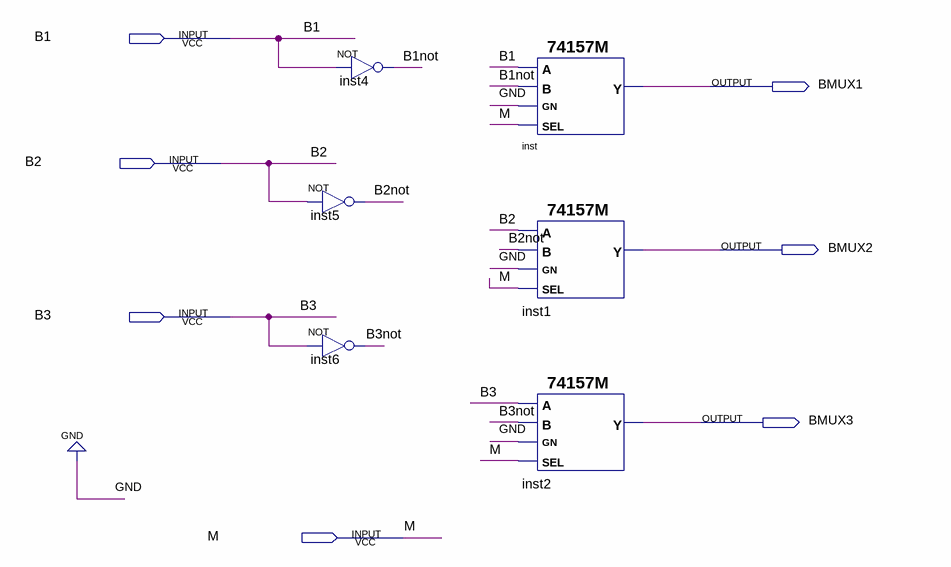
[diagram p0: schematic sheet]
// Quartus schematic MUX.bdf as structural Verilog: 6 symbols, 7 pins
module MUX (
  input  B1,
  input  B2,
  input  B3,
  input  M,
  output BMUX1,
  output BMUX2,
  output BMUX3
);

  wire B1not, B2not, B3not;

  not inst4 (B1not, B1);
  not inst5 (B2not, B2);
  not inst6 (B3not, B3);
  \74157M  inst (.SEL(M), .GN(1'b0), .B(B1not), .A(B1), .Y(BMUX1));
  \74157M  inst1 (.SEL(M), .GN(1'b0), .B(B2not), .A(B2), .Y(BMUX2));
  \74157M  inst2 (.SEL(M), .GN(1'b0), .B(B3not), .A(B3), .Y(BMUX3));
endmodule
